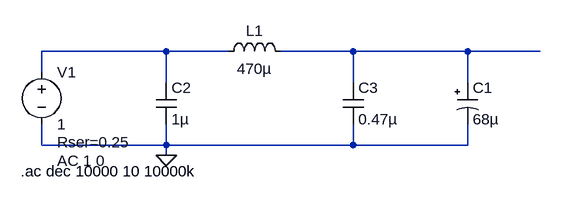
[diagram p0: schematic filter_motor.asc]
filter_motor.asc, the LTspice schematic file:
Version 4
SHEET 1 880 680
WIRE 128 80 -64 80
WIRE 224 80 128 80
WIRE 416 80 304 80
WIRE 592 80 416 80
WIRE 704 80 592 80
WIRE -64 112 -64 80
WIRE 128 128 128 80
WIRE 416 128 416 80
WIRE 592 128 592 80
WIRE -64 224 -64 192
WIRE 128 224 128 192
WIRE 128 224 -64 224
WIRE 416 224 416 192
WIRE 416 224 128 224
WIRE 592 224 592 192
WIRE 592 224 416 224
WIRE 128 240 128 224
FLAG 128 240 0
SYMBOL cap 112 128 R0
SYMATTR InstName C2
SYMATTR Value 1µ
SYMATTR SpiceLine V=25 Irms=5.18 Rser=0.0171188 Lser=1n
SYMBOL cap 400 128 R0
SYMATTR InstName C3
SYMATTR Value 0.47µ
SYMATTR SpiceLine V=25 Irms=3.94 Rser=0.0265693 Lser=1n
SYMBOL ind 208 96 R270
WINDOW 0 32 56 VTop 2
WINDOW 3 5 56 VBottom 2
SYMATTR InstName L1
SYMATTR Value 470µ
SYMATTR SpiceLine Ipk=2 Rser=0.4 Rpar=0 Cpar=0
SYMBOL voltage -64 96 R0
WINDOW 123 24 152 Left 2
WINDOW 39 24 124 Left 2
SYMATTR Value2 AC 1 0
SYMATTR SpiceLine Rser=0.25
SYMATTR InstName V1
SYMATTR Value 1
SYMBOL polcap 576 128 R0
WINDOW 3 24 56 Left 2
SYMATTR Value 68µ
SYMATTR InstName C1
SYMATTR Description Capacitor
SYMATTR Type cap
SYMATTR SpiceLine V=50 Irms=3.72678 Rser=0.025 Lser=30n
TEXT -96 264 Left 2 !.ac dec 10000 10 10000k

The netlist it stands for:
* filter_motor.asc
C2 N001 0 1µ V=25 Irms=5.18 Rser=0.0171188 Lser=1n
C3 N002 0 0.47µ V=25 Irms=3.94 Rser=0.0265693 Lser=1n
L1 N001 N002 470µ Ipk=2 Rser=0.4 Rpar=0 Cpar=0
V1 N001 0 1 AC 1 0 Rser=0.25
C1 N002 0 68µ V=50 Irms=3.72678 Rser=0.025 Lser=30n
.ac dec 10000 10 10000k
.backanno
.end